# Altium schematic sheet hall_sensors.SchDoc
size A4; SheetNumber: 1; SheetTotal: 4
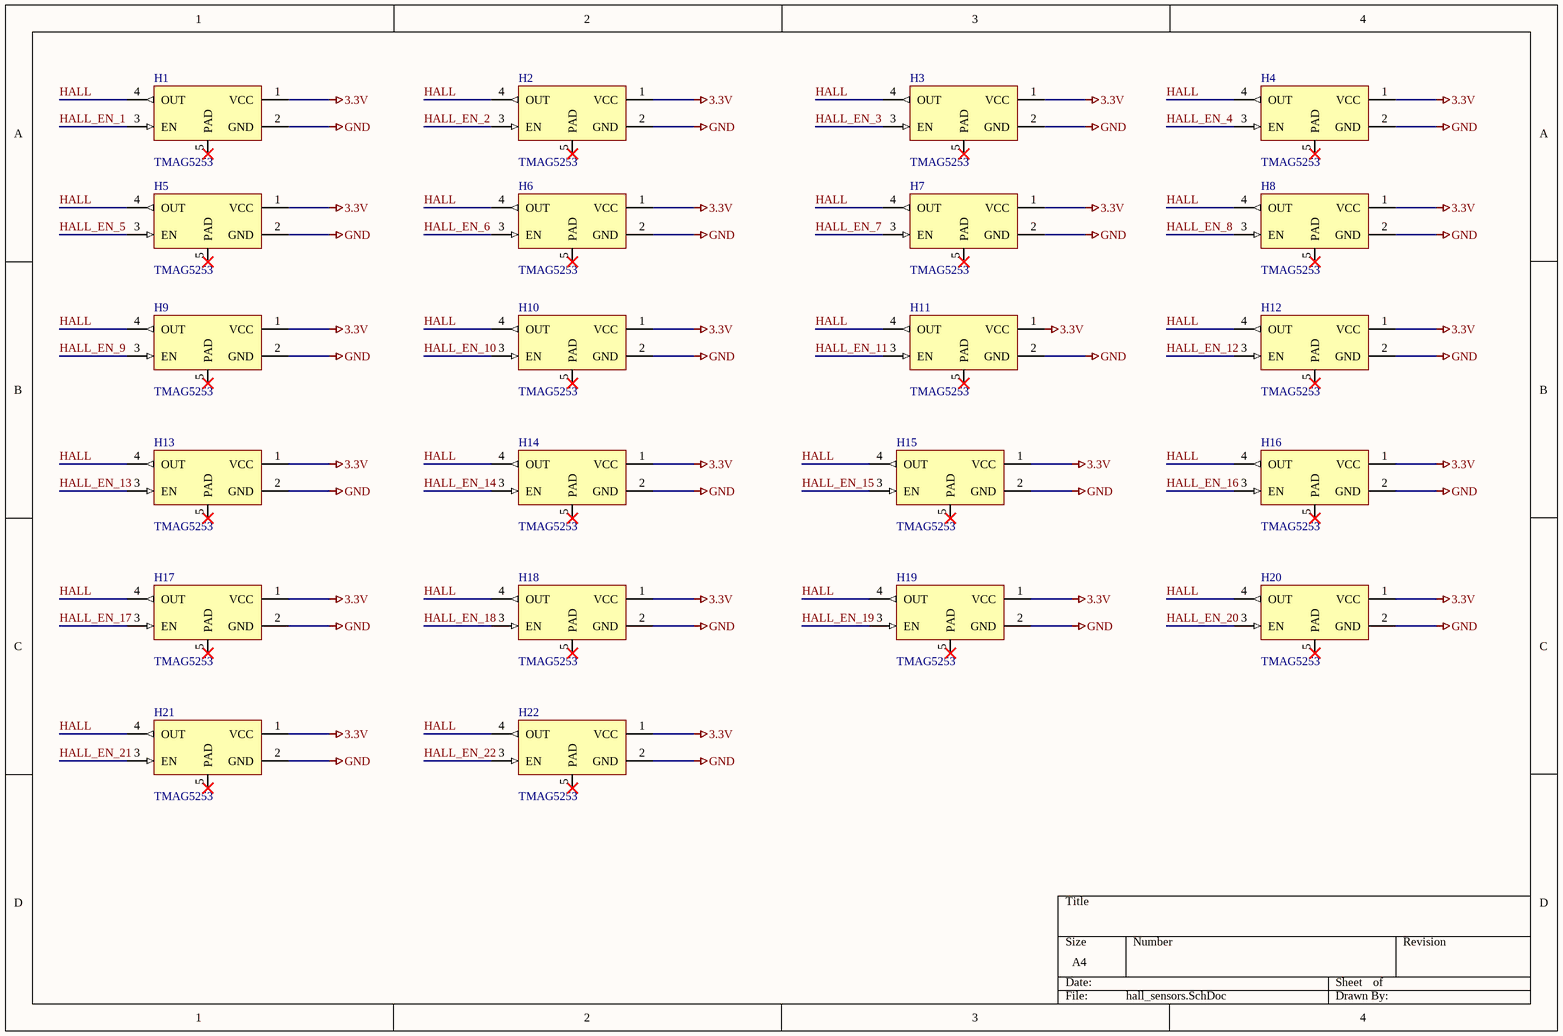
[diagram p0: hall_sensors.SchDoc]

## Parts
H1  TMAG5253  [IC_TMAG5253BA3IQDMRR]
H2  TMAG5253  [IC_TMAG5253BA3IQDMRR]
H3  TMAG5253  [IC_TMAG5253BA3IQDMRR]
H4  TMAG5253  [IC_TMAG5253BA3IQDMRR]
H5  TMAG5253  [IC_TMAG5253BA3IQDMRR]
H6  TMAG5253  [IC_TMAG5253BA3IQDMRR]
H7  TMAG5253  [IC_TMAG5253BA3IQDMRR]
H8  TMAG5253  [IC_TMAG5253BA3IQDMRR]
H9  TMAG5253  [IC_TMAG5253BA3IQDMRR]
H10  TMAG5253  [IC_TMAG5253BA3IQDMRR]
H11  TMAG5253  [IC_TMAG5253BA3IQDMRR]
H12  TMAG5253  [IC_TMAG5253BA3IQDMRR]
H13  TMAG5253  [IC_TMAG5253BA3IQDMRR]
H14  TMAG5253  [IC_TMAG5253BA3IQDMRR]
H15  TMAG5253  [IC_TMAG5253BA3IQDMRR]
H16  TMAG5253  [IC_TMAG5253BA3IQDMRR]
H17  TMAG5253  [IC_TMAG5253BA3IQDMRR]
H18  TMAG5253  [IC_TMAG5253BA3IQDMRR]
H19  TMAG5253  [IC_TMAG5253BA3IQDMRR]
H20  TMAG5253  [IC_TMAG5253BA3IQDMRR]
H21  TMAG5253  [IC_TMAG5253BA3IQDMRR]
H22  TMAG5253  [IC_TMAG5253BA3IQDMRR]

## Nets
3.3V: H1.1(VCC) H2.1(VCC) H3.1(VCC) H4.1(VCC) H5.1(VCC) H6.1(VCC) H7.1(VCC) H8.1(VCC) H9.1(VCC) H10.1(VCC) H11.1(VCC) H12.1(VCC) H13.1(VCC) H14.1(VCC) H15.1(VCC) H16.1(VCC) H17.1(VCC) H18.1(VCC) H19.1(VCC) H20.1(VCC) H21.1(VCC) H22.1(VCC)
GND: H1.2(GND) H2.2(GND) H3.2(GND) H4.2(GND) H5.2(GND) H6.2(GND) H7.2(GND) H8.2(GND) H9.2(GND) H10.2(GND) H11.2(GND) H12.2(GND) H13.2(GND) H14.2(GND) H15.2(GND) H16.2(GND) H17.2(GND) H18.2(GND) H19.2(GND) H20.2(GND) H21.2(GND) H22.2(GND)
HALL: H1.4(OUT) H2.4(OUT) H3.4(OUT) H4.4(OUT) H5.4(OUT) H6.4(OUT) H7.4(OUT) H8.4(OUT) H9.4(OUT) H10.4(OUT) H11.4(OUT) H12.4(OUT) H13.4(OUT) H14.4(OUT) H15.4(OUT) H16.4(OUT) H17.4(OUT) H18.4(OUT) H19.4(OUT) H20.4(OUT) H21.4(OUT) H22.4(OUT)
HALL_EN_1: H1.3(EN)
HALL_EN_2: H2.3(EN)
HALL_EN_3: H3.3(EN)
HALL_EN_4: H4.3(EN)
HALL_EN_5: H5.3(EN)
HALL_EN_6: H6.3(EN)
HALL_EN_7: H7.3(EN)
HALL_EN_8: H8.3(EN)
HALL_EN_9: H9.3(EN)
HALL_EN_10: H10.3(EN)
HALL_EN_11: H11.3(EN)
HALL_EN_12: H12.3(EN)
HALL_EN_13: H13.3(EN)
HALL_EN_14: H14.3(EN)
HALL_EN_15: H15.3(EN)
HALL_EN_16: H16.3(EN)
HALL_EN_17: H17.3(EN)
HALL_EN_18: H18.3(EN)
HALL_EN_19: H19.3(EN)
HALL_EN_20: H20.3(EN)
HALL_EN_21: H21.3(EN)
HALL_EN_22: H22.3(EN)

Not connected (* = marked no-connect by the designer): H1 5(PAD)*; H2 5(PAD)*; H3 5(PAD)*; H4 5(PAD)*; H5 5(PAD)*; H6 5(PAD)*; H7 5(PAD)*; H8 5(PAD)*; H9 5(PAD)*; H10 5(PAD)*; H11 5(PAD)*; H12 5(PAD)*; H13 5(PAD)*; H14 5(PAD)*; H15 5(PAD)*; H16 5(PAD)*; H17 5(PAD)*; H18 5(PAD)*; H19 5(PAD)*; H20 5(PAD)*; H21 5(PAD)*; H22 5(PAD)*

## Library data of the parts
H1-H22 = TMAG5253: Low-power linear Hall-effect sensor with enable pin in ultrasmall X2SON package; BOM_GROUP: HALL Switches; MF: Texas Instruments; MP: TMAG5253BA3IQDMRR; SnapEDA_Link: https://www.snapeda.com/parts/TMAG5253BA3IQDMRR/Texas+Instruments/view-part/?ref=snap; Package: XFDFN-4 Texas Instruments; Check_prices: https://www.snapeda.com/parts/TMAG5253BA3IQDMRR/Texas+Instruments/view-part/?ref=eda; Parameter 1: *